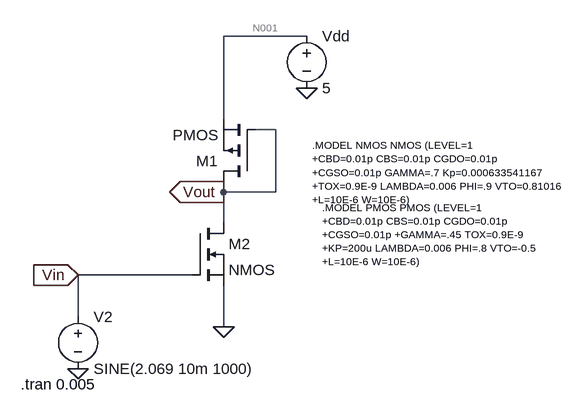
[diagram p0: schematic third.asc]
third.asc, the LTspice schematic file:
Version 4
SHEET 1 880 680
WIRE 288 -112 160 -112
WIRE 160 16 160 -112
WIRE 240 32 208 32
WIRE 160 128 160 112
WIRE 240 128 240 32
WIRE 240 128 160 128
WIRE 160 176 160 128
WIRE 112 256 -64 256
WIRE -64 320 -64 256
WIRE 160 336 160 272
FLAG 160 336 0
FLAG -64 400 0
FLAG -64 256 Vin
IOPIN -64 256 In
FLAG 288 -32 0
FLAG 160 128 Vout
IOPIN 160 128 Out
SYMBOL nmos 112 176 R0
SYMATTR InstName M2
SYMBOL voltage 288 -128 R0
WINDOW 123 0 0 Left 0
WINDOW 39 0 0 Left 0
SYMATTR InstName Vdd
SYMATTR Value 5
SYMBOL voltage -64 304 R0
WINDOW 123 0 0 Left 0
WINDOW 39 0 0 Left 0
SYMATTR InstName V2
SYMATTR Value SINE(2.069 10m 1000)
SYMBOL pmos 208 112 R180
SYMATTR InstName M1
TEXT 296 56 Left 1 !.MODEL NMOS NMOS (LEVEL=1 \n+CBD=0.01p CBS=0.01p CGDO=0.01p \n+CGSO=0.01p GAMMA=.7 Kp=0.000633541167\n+TOX=0.9E-9 LAMBDA=0.006 PHI=.9 VTO=0.81016\n+L=10E-6 W=10E-6)
TEXT 312 152 Left 1 !.MODEL PMOS PMOS (LEVEL=1 \n+CBD=0.01p CBS=0.01p CGDO=0.01p \n+CGSO=0.01p +GAMMA=.45 TOX=0.9E-9 \n+KP=200u LAMBDA=0.006 PHI=.8 VTO=-0.5\n+L=10E-6 W=10E-6)
TEXT -152 424 Left 2 !.tran 0.005

The netlist it stands for:
* third.asc
M2 Vout Vin 0 0 NMOS
Vdd N001 0 5
V2 Vin 0 SINE(2.069 10m 1000)
M1 Vout Vout N001 N001 PMOS
.model NMOS NMOS
.model PMOS PMOS
.lib standard.mos
.MODEL NMOS NMOS (LEVEL=1
+CBD=0.01p CBS=0.01p CGDO=0.01p
+CGSO=0.01p GAMMA=.7 Kp=0.000633541167
+TOX=0.9E-9 LAMBDA=0.006 PHI=.9 VTO=0.81016
+L=10E-6 W=10E-6)
.MODEL PMOS PMOS (LEVEL=1
+CBD=0.01p CBS=0.01p CGDO=0.01p
+CGSO=0.01p +GAMMA=.45 TOX=0.9E-9
+KP=200u LAMBDA=0.006 PHI=.8 VTO=-0.5
+L=10E-6 W=10E-6)
.tran 0.005
.backanno
.end

* Results of the author's LTspice run, read from the files saved beside the schematic
* Operating Point, zero values left out:
*   V(vout) = 2.263 V
*   V(vin) = 2.069 V
*   V(n001) = 5 V
*   Id(M2) = 508.8 µA
*   Ib(M2) = -2.273 pA
*   Is(M2) = -508.8 µA
*   Id(M1) = -508.8 µA
*   Ib(M1) = 2.747 pA
*   Is(M1) = 508.8 µA
*   I(Vdd) = -508.8 µA